# Altium schematic sheet SCH_POTENCIA.SchDoc
size A4
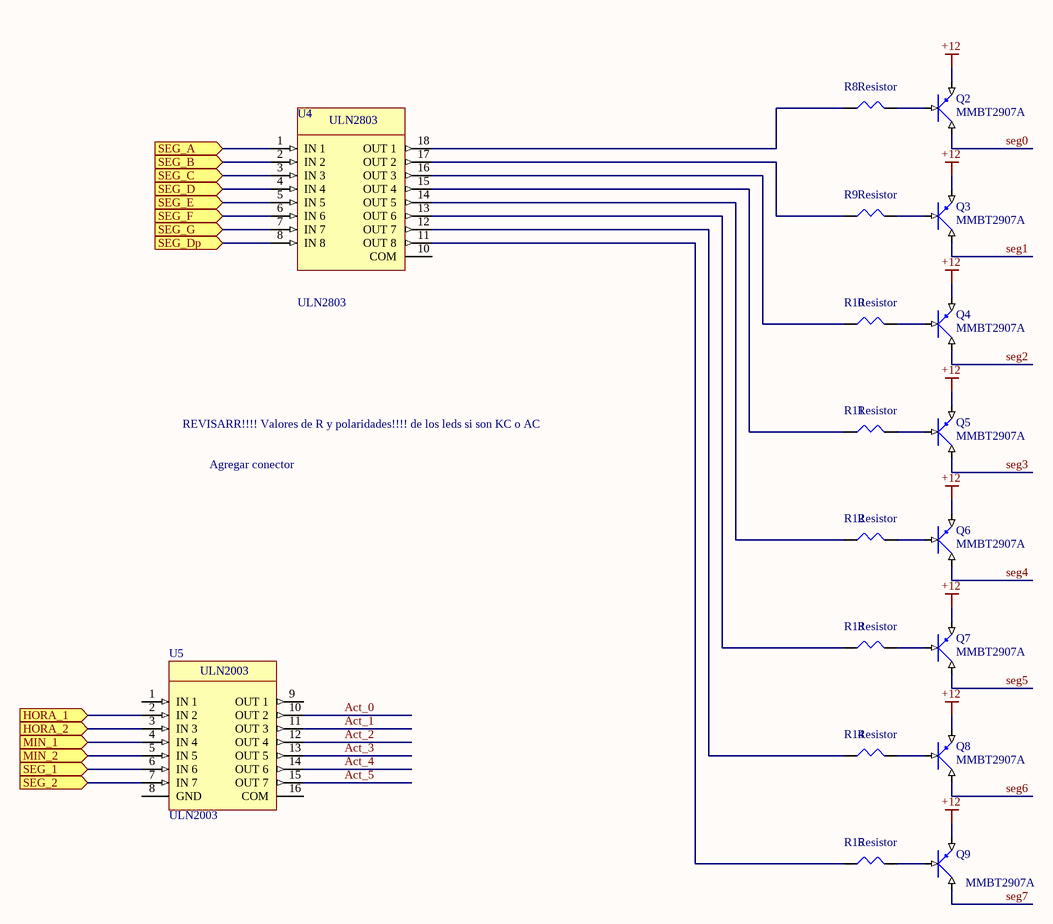
[diagram p0: SCH_POTENCIA.SchDoc]

## Parts
Q2  MMBT2907A
Q3  MMBT2907A
Q4  MMBT2907A
Q5  MMBT2907A
Q6  MMBT2907A
Q7  MMBT2907A
Q8  MMBT2907A
Q9  MMBT2907A
R8  Resistor
R9  Resistor
R10  Resistor
R11  Resistor
R12  Resistor
R13  Resistor
R14  Resistor
R15  Resistor
U4  ULN2803
U5  ULN2003

## Ports
HORA_1 (in), HORA_2 (in), MIN_1 (in), MIN_2 (in), SEG_1 (in), SEG_2 (in), SEG_A (in), SEG_B (in), SEG_C (in), SEG_D (in), SEG_Dp (in), SEG_E (in), SEG_F (in), SEG_G (in)

## Nets
+12: Q2.3(E) Q3.3(E) Q4.3(E) Q5.3(E) Q6.3(E) Q7.3(E) Q8.3(E) Q9.3(E)
Act_0: U5.10(OUT_2)
Act_1: U5.11(OUT_3)
Act_2: U5.12(OUT_4)
Act_3: U5.13(OUT_5)
Act_4: U5.14(OUT_6)
Act_5: U5.15(OUT_7)
HORA_1: U5.2(IN_2) ; port HORA_1
HORA_2: U5.3(IN_3) ; port HORA_2
MIN_1: U5.4(IN_4) ; port MIN_1
MIN_2: U5.5(IN_5) ; port MIN_2
seg0: Q2.2(C)
seg1: Q3.2(C)
seg2: Q4.2(C)
seg3: Q5.2(C)
seg4: Q6.2(C)
seg5: Q7.2(C)
seg6: Q8.2(C)
seg7: Q9.2(C)
SEG_1: U5.6(IN_6) ; port SEG_1
SEG_2: U5.7(IN_7) ; port SEG_2
SEG_A: U4.1(IN_1) ; port SEG_A
SEG_B: U4.2(IN_2) ; port SEG_B
SEG_C: U4.3(IN_3) ; port SEG_C
SEG_D: U4.4(IN_4) ; port SEG_D
SEG_Dp: U4.8(IN_8) ; port SEG_Dp
SEG_E: U4.5(IN_5) ; port SEG_E
SEG_F: U4.6(IN_6) ; port SEG_F
SEG_G: U4.7(IN_7) ; port SEG_G
NetQ2_1: Q2.1(B) R8.48
NetQ3_1: Q3.1(B) R9.48
NetQ4_1: Q4.1(B) R10.48
NetQ5_1: Q5.1(B) R11.48
NetQ6_1: Q6.1(B) R12.48
NetQ7_1: Q7.1(B) R13.48
NetQ8_1: Q8.1(B) R14.48
NetQ9_1: Q9.1(B) R15.48
NetR8_47: R8.47 U4.18(OUT_1)
NetR9_47: R9.47 U4.17(OUT_2)
NetR10_47: R10.47 U4.16(OUT_3)
NetR11_47: R11.47 U4.15(OUT_4)
NetR12_47: R12.47 U4.14(OUT_5)
NetR13_47: R13.47 U4.13(OUT_6)
NetR14_47: R14.47 U4.12(OUT_7)
NetR15_47: R15.47 U4.11(OUT_8)

Not connected (* = marked no-connect by the designer): U4 10(COM); U5 1(IN_1) 8(GND) 9(OUT_1) 16(COM)

## Notes on the sheet
- REVISARR!!!! Valores de R y polaridades!!!! de los leds si son KC o AC
- Agregar conector
- Title:
- Size:
- Author:
- A4
- Sheet
- of
- Revision:
- File:
- Date:

## Library data of the parts
Q2-Q9 = PNP_TRANSISTOR: Número de pieza de Digi-Key MMBT2907A-FDICT-ND